# EAGLE design dht22 (EAGLE 7.6.0)
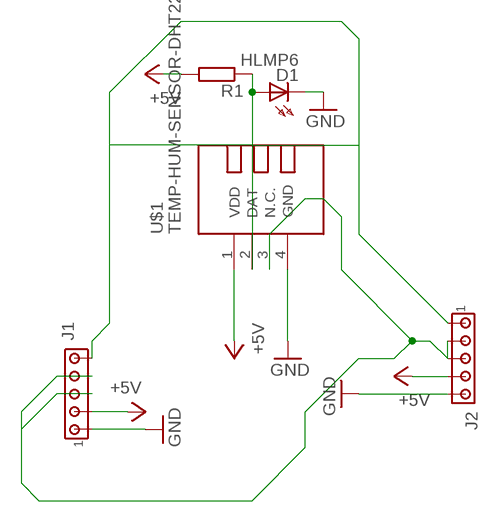
[diagram p0: schematic, sheet 1]

## Parts
D1  HLMP6  [HLMP6]
J1  MTA05-100  [10X05MTA]
J2  MTA05-100  [10X05MTA]
R1  R-EU_0309/10  [0309/10]
U$1  TEMP-HUM-SENSOR-DHT22  [TEMP-HUM-SENSOR-DHT22]

## Nets
+5V: J1.2 J2.4 R1.2 U$1.1(VDD)
GND: D1.K J1.1 J2.5 U$1.4(GND)
N$2: D1.A J1.5 J2.1 R1.1 U$1.2(DAT)
N$4: J1.3 J1.4 J2.2 J2.3 U$1.3(N.C.)

## Library data of the parts
D1 = display-hp:HLMP6: LED 2mm horizontal; MF: AGILENT TECHNOLOGIES; MPN: HLMP-6500; OC_FARNELL: 1652490; OC_NEWARK: 40K0088
J1 J2 = con-amp:MTA05-100: AMP connector
R1 = rcl:R-EU_: RESISTOR, European symbol
U$1 = diy-modules:TEMP-HUM-SENSOR-DHT22: DHT22 - digital humidity & temperature sensor Also known as: AM2302 AM2302 datasheet available here: http://akizukidenshi.com/download/ds/aosong/AM2302.pdf Click here to find device on ebay.com <http://www.ebay.com/sch/dht22+digital+sensor>

## Board
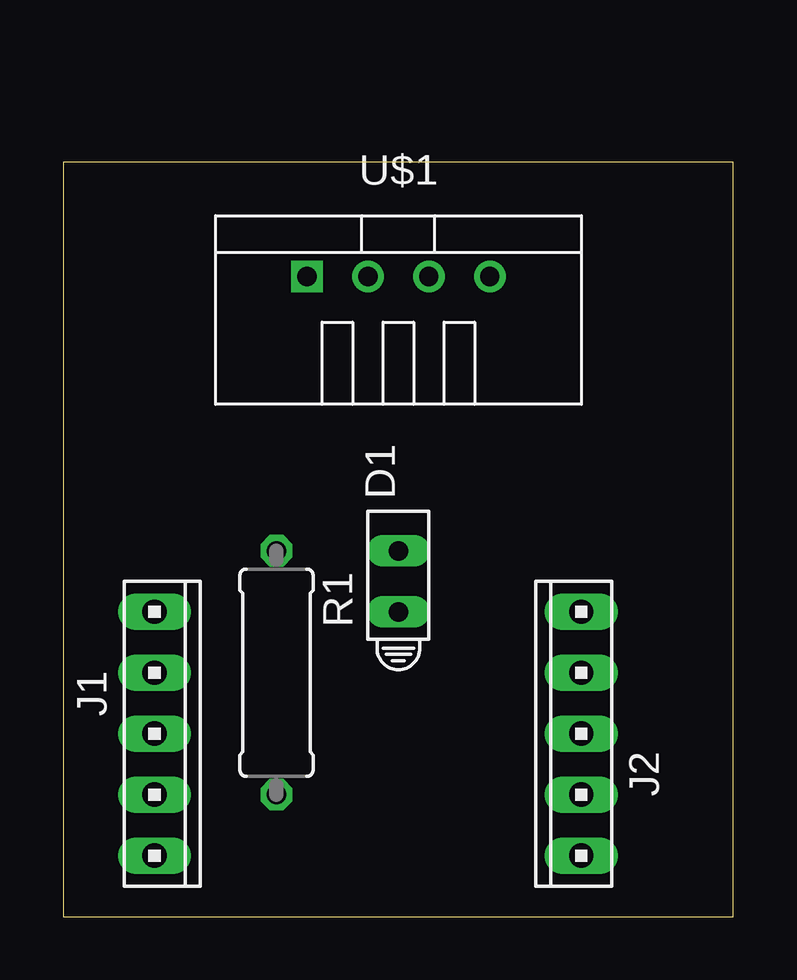
[diagram p1: board, top side]
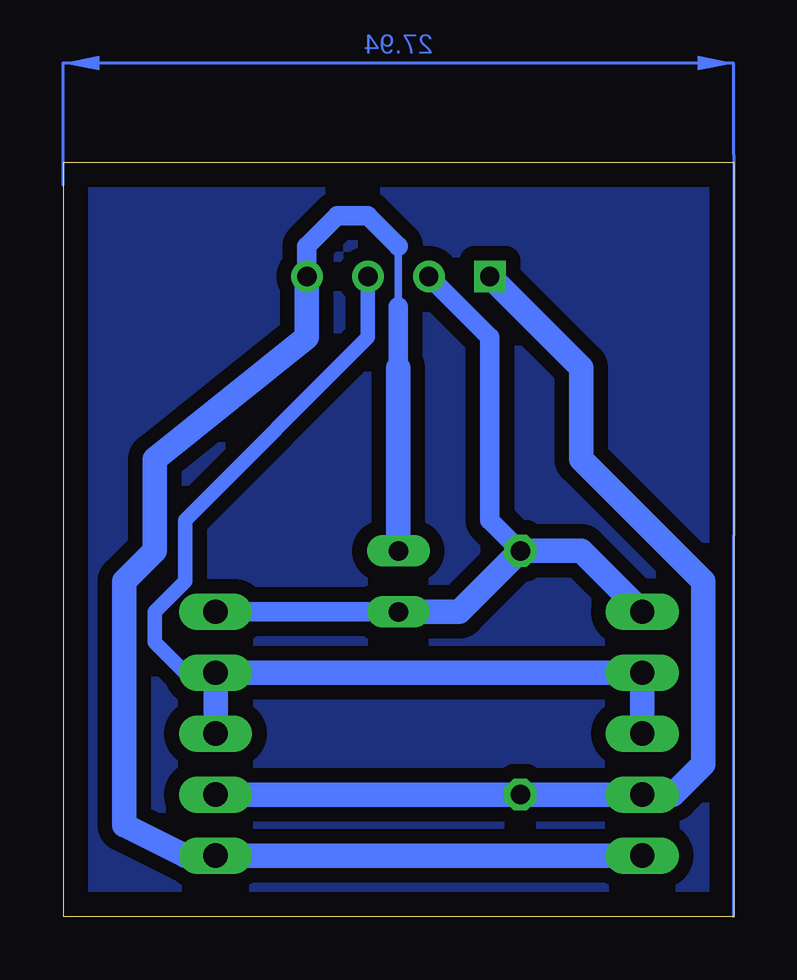
[diagram p2: board, bottom side, seen from below]

Size 27.92 x 31.42 mm. Coordinates in mm from the lower left corner, seen from the top.
Outline: 0,0 27.92,0 27.92,31.42 0,31.42 0,0
Copper layers (1*16): Top 0.035mm / dielectric 1.5mm / Bottom 0.035mm
Design rules "default": minimum track width 10mil, minimum drill 24mil, track to track 8mil, track to pad 8mil, pad to pad 8mil, via to via 8mil, smd to smd 8mil, copper to edge 40mil, drill to drill 8mil, minimum pad ring 10mil, minimum via ring 8mil, stop-mask expansion 4mil, vias tented up to drill 0mil, thermal gap 10mil

### Footprints (pad centres in the part's own frame; a part is rotated, then mirrored left to right if it is on the bottom)
HLMP6 = drill 0.813 long: A -1.27,0; K 1.27,0
10X05MTA = drill 1.016 long: 1 5.08,0; 2 2.54,0; 3 0,0; 4 -2.54,0; 5 -5.08,0
0309/10 = drill 0.813 octagon: 1 -5.08,0; 2 5.08,0
TEMP-HUM-SENSOR-DHT22 = drill 0.8 square: 1 -3.81,0 | drill 0.8: 2 -1.27,0; 3 1.27,0; 4 3.81,0

### Placement (x,y rotation side)
D1  13.97,13.97 90 top
J1  3.81,7.62 270 top
J2  21.59,7.62 90 top
R1  8.89,10.16 270 top
U$1  13.97,26.67 0 top

### Tracks (layer width: path | path; a pad name or v marks a point on that pad's centre or on a via)
+5V
  Bottom 1.016: J2.4 R1.2 J1.2 2.54,5.08 1.27,6.35 1.27,13.97 6.35,19.05 6.35,22.86 U$1.1
GND
  Bottom 0.305: 13.97,25.4 13.97,27.94
  Bottom 0.813: 13.97,22.86 13.97,25.4 | 13.97,27.94 15.24,29.21 16.51,29.21 17.78,27.94 U$1.4
  Bottom 1.016: J1.1 J2.5 22.86,2.54 25.4,3.81 25.4,13.97 24.13,15.24 24.13,19.05 17.78,24.13 U$1.4 | D1.K 13.97,22.86
N$1
  pour Bottom (isolate 0.61): 0,0 0,31.75 27.94,31.75 27.94,0
N$2
  Bottom 0.813: U$1.2 10.16,24.13 10.16,16.51 R1.1 | D1.A J2.1
  Bottom 1.016: D1.A 11.43,12.7 R1.1 6.35,15.24 J1.5
N$4
  Bottom 0.61: J2.2 22.86,10.16 24.13,11.43 24.13,12.7 22.86,13.97 22.86,16.51 15.24,24.13 U$1.3
  Bottom 1.016: J1.3 J1.4 J2.2 J2.3
(copper drawn outside any net)
  shapes: Bottom area x2